# EAGLE schematic Regulator_LDO_MIC5219 (EAGLE 6.5.0)
LDO Regulator: MIC5219 MIC5219 Datasheet <http://www.micrel.com/_PDF/mic5219.pdf> Supports fixed voltages at 2.5V, 2.85V, 3V, 3.3V, 3.6V, 5.0V and output currents between 500mA Input voltages are 2.5V to 12V
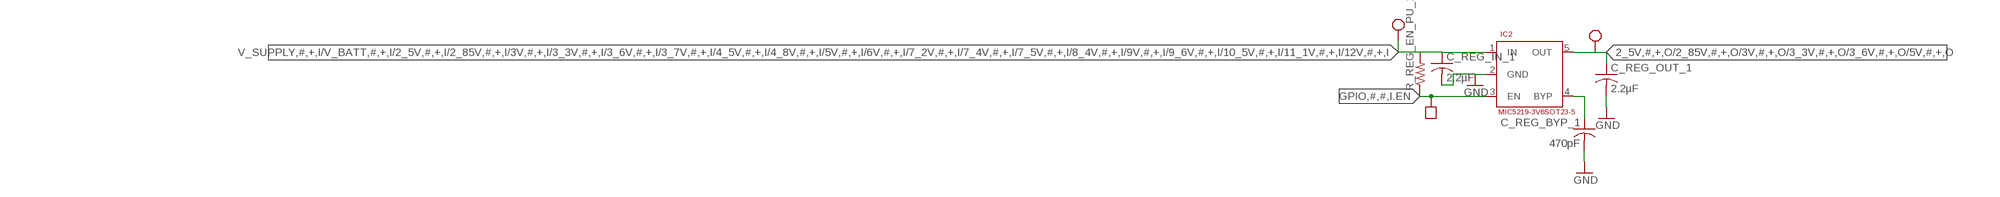
[diagram p0: schematic, sheet 1]

## Parts
C_REG_BYP_1  470pF  C-USC0603  [C0603]
C_REG_IN_1  2.2µF  C-USC0603  [C0603]
C_REG_OUT_1  2.2µF  C-USC0603  [C0603]
IC2  MIC5219-3V6SOT23-5  [SOT23-5L]
R_REG_EN_PU_1  R-US_R0603  [R0603]

## Nets
2_5V,#,+,O/2_85V,#,+,O/3V,#,+,O/3_3V,#,+,O/3_6V,#,+,O/5V,#,+,O: C_REG_OUT_1.1 IC2.5(OUT) ; supply symbol labelled BLOCK_REQUIREMENT
GND: C_REG_BYP_1.2 C_REG_IN_1.2 C_REG_OUT_1.2 IC2.2(GND)
GPIO,#,#,I.EN: IC2.3(EN) R_REG_EN_PU_1.1 ; supply symbol labelled BLOCK_OPTIONAL
REG_BYP: C_REG_BYP_1.1 IC2.4(BYP)
V_SUPPLY,#,+,I/V_BATT,#,+,I/2_5V,#,+,I/2_85V,#,+,I/3V,#,+,I/3_3V,#,+,I/3_6V,#,+,I/3_7V,#,+,I/4_5V,#,+,I/4_8V,#,+,I/5V,#,+,I/6V,#,+,I/7_2V,#,+,I/7_4V,#,+,I/7_5V,#,+,I/8_4V,#,+,I/9V,#,+,I/9_6V,#,+,I/10_5V,#,+,I/11_1V,#,+,I/12V,#,+,I: C_REG_IN_1.1 IC2.1(IN) R_REG_EN_PU_1.2 ; supply symbol labelled BLOCK_REQUIREMENT

## Library data of the parts
C_REG_BYP_1 C_REG_IN_1 C_REG_OUT_1 = resistor:C-US: CAPACITOR, American symbol
IC2 = neels:MIC5219-3V6
R_REG_EN_PU_1 = resistor:R-US_: RESISTOR, American symbol